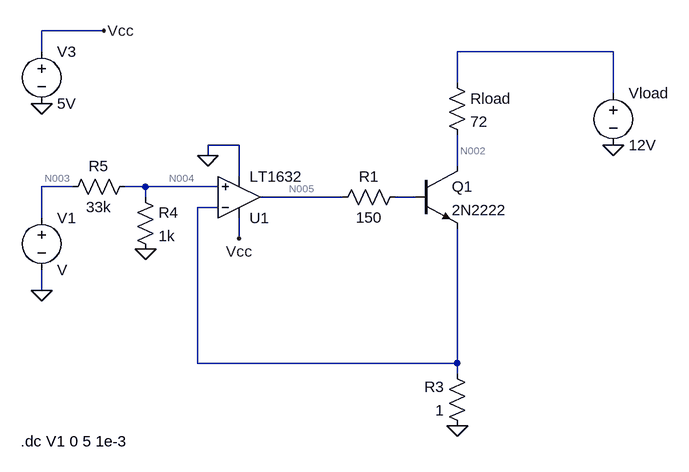
[diagram p0: schematic yig_current_regulator.asc]
yig_current_regulator.asc, the LTspice schematic file:
Version 4
SHEET 1 880 680
WIRE -80 -80 -176 -80
WIRE -176 -48 -176 -80
WIRE 704 -48 464 -48
WIRE 464 0 464 -48
WIRE 704 16 704 -48
WIRE 128 96 80 96
WIRE 80 112 80 96
WIRE 464 128 464 80
WIRE 128 144 128 96
WIRE -128 160 -176 160
WIRE -16 160 -48 160
WIRE 96 160 -16 160
WIRE -16 176 -16 160
WIRE 288 176 160 176
WIRE 400 176 368 176
WIRE 96 192 64 192
WIRE -176 208 -176 160
WIRE 128 240 128 208
WIRE -176 320 -176 288
WIRE 64 432 64 192
WIRE 464 432 464 224
WIRE 464 432 64 432
WIRE 464 448 464 432
FLAG -176 320 0
FLAG 704 96 0
FLAG 464 528 0
FLAG 80 112 0
FLAG -176 32 0
FLAG -80 -80 Vcc
FLAG 128 240 Vcc
FLAG -16 256 0
SYMBOL OpAmps\\LT1632 128 240 M180
SYMATTR InstName U1
SYMBOL npn 400 128 R0
SYMATTR InstName Q1
SYMATTR Value 2N2222
SYMBOL res 384 160 R90
WINDOW 0 0 56 VBottom 2
WINDOW 3 32 56 VTop 2
SYMATTR InstName R1
SYMATTR Value 150
SYMBOL res 480 544 R180
WINDOW 0 36 76 Left 2
WINDOW 3 36 40 Left 2
SYMATTR InstName R3
SYMATTR Value 1
SYMBOL voltage -176 192 R0
SYMATTR InstName V1
SYMBOL res 448 -16 R0
SYMATTR InstName Rload
SYMATTR Value 72
SYMBOL voltage 704 0 R0
WINDOW 123 0 0 Left 0
WINDOW 39 0 0 Left 0
SYMATTR InstName Vload
SYMATTR Value 12V
SYMBOL voltage -176 -64 R0
WINDOW 123 0 0 Left 0
WINDOW 39 0 0 Left 0
SYMATTR InstName V3
SYMATTR Value 5V
SYMBOL res -32 160 R0
SYMATTR InstName R4
SYMATTR Value 1k
SYMBOL res -32 144 R90
WINDOW 0 0 56 VBottom 2
WINDOW 3 32 56 VTop 2
SYMATTR InstName R5
SYMATTR Value 33k
TEXT -208 552 Left 2 !.dc V1 0 5 1e-3

The netlist it stands for:
* yig_current_regulator.asc
XU1 N004 N007 Vcc 0 N005 LT1632  ; pins In+ In- V+ V- OUT
Q1 N002 N006 N007 0 2N2222
R1 N006 N005 150
R3 0 N007 1
V1 N003 0 V
Rload N001 N002 72
Vload N001 0 12V
V3 Vcc 0 5V
R4 N004 0 1k
R5 N004 N003 33k
.model NPN NPN
.model PNP PNP
.lib standard.bjt
.dc V1 0 5 1e-3
.lib LTC.lib
.backanno
.end

* Results of the author's LTspice run, read from the files saved beside the schematic
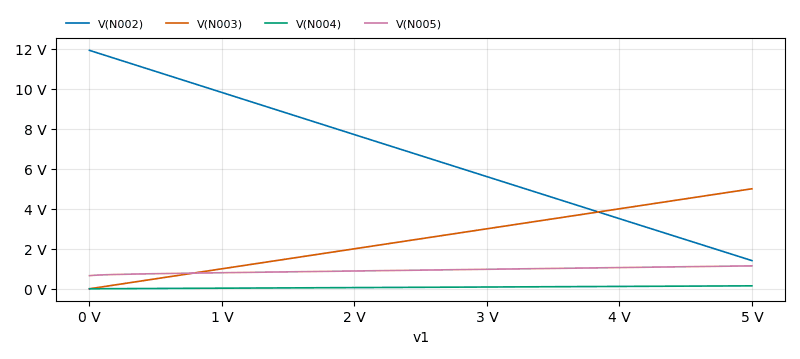
[diagram p1: DC transfer characteristic of yig_current_regulator.asc, plotted from the saved traces]
* DC transfer characteristic, 1 run:
*   V(N002): 11.92 V at v1=0 V, 1.41 V at v1=5 V, min 1.41 V, max 11.92 V
*   V(N003): 0 V at v1=0 V, 5 V at v1=5 V, min 0 V, max 5 V
*   V(N004): 1.119 mV at v1=0 V, 148.2 mV at v1=5 V, min 1.119 mV, max 148.2 mV
*   V(N005): 657.4 mV at v1=0 V, 1.147 V at v1=5 V, min 657.4 mV, max 1.147 V